# Altium schematic sheet EDU_High-Speed-Design_Ethernet.SchDoc: Ethernet
size 431 x 279 mm; Date: not used; ApprovedBy: not used; CheckedBy: not used; Author: not used; DrawnBy: not used; Organization: not used; Address4: not used; SheetNumber: 8; SheetTotal: 26; Time: not used; ImagePath: not used; Application_BuildNumber: not used
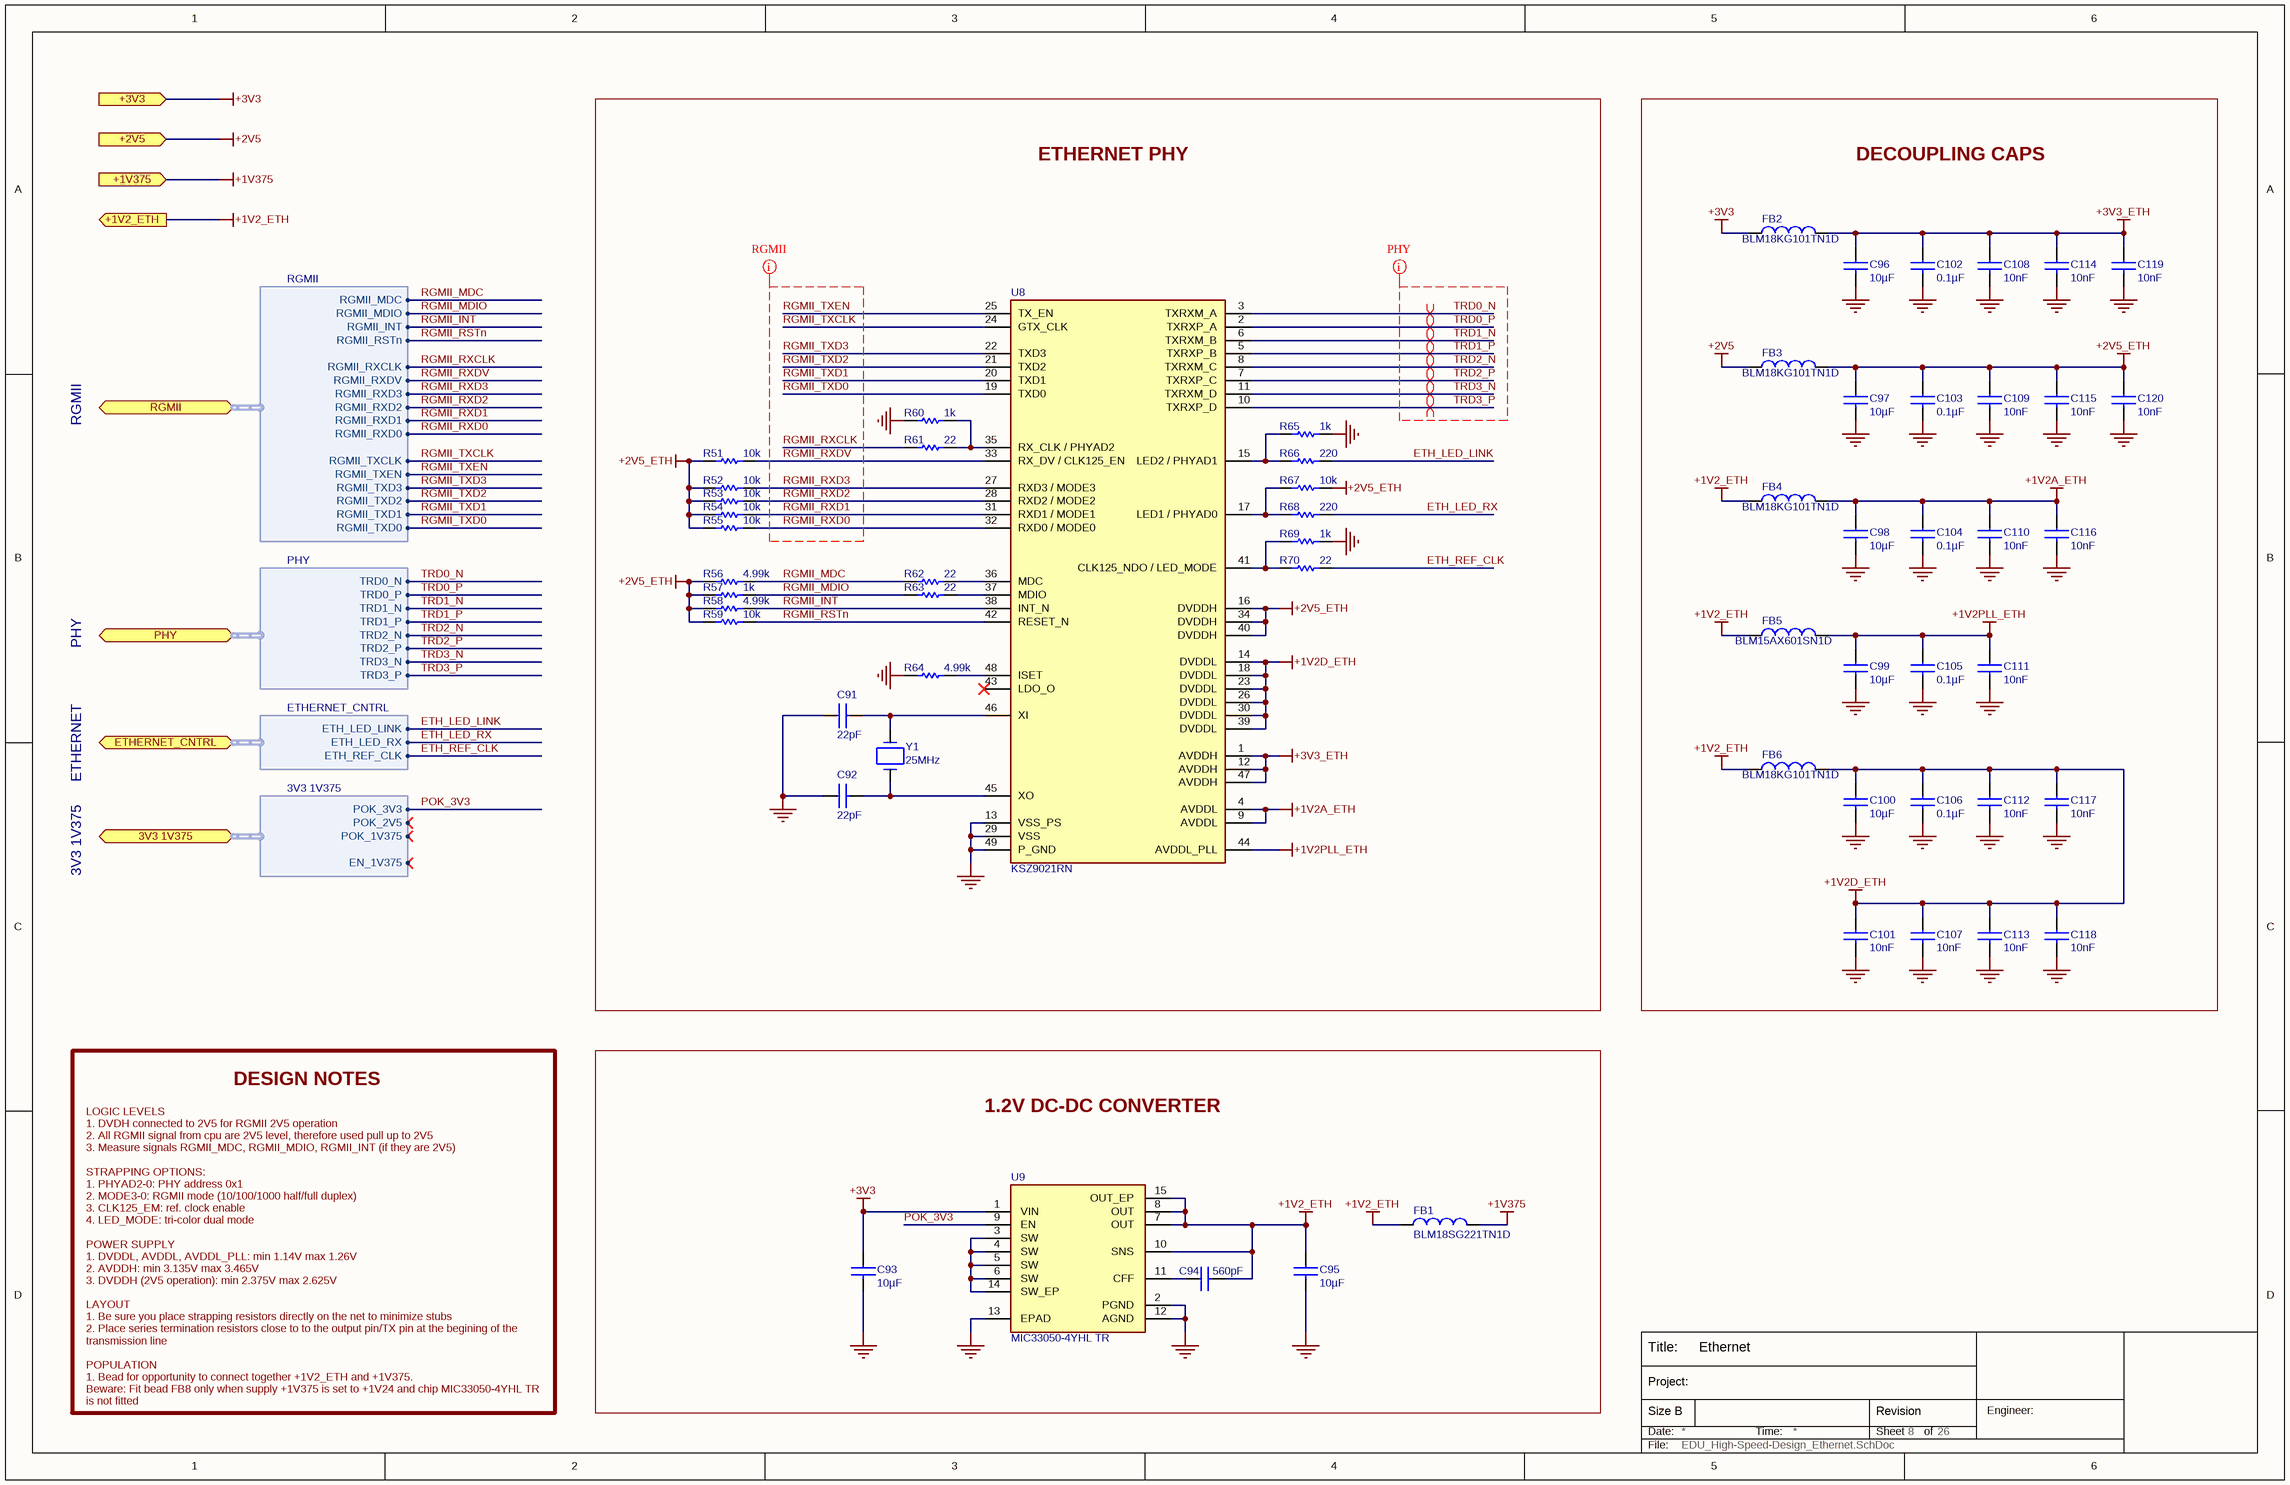
[diagram p0: EDU_High-Speed-Design_Ethernet.SchDoc]

## Parts
C91  22pF  [C0402]
C92  22pF  [C0402]
C93  10µF  [C0603]
C94  560pF  [C0402]
C95  10µF  [C0603]
C96  10µF  [C0603]
C97  10µF  [C0603]
C98  10µF  [C0603]
C99  10µF  [C0603]
C100  10µF  [C0603]
C101  10nF  [C0402]
C102  0.1µF  [C0402]
C103  0.1µF  [C0402]
C104  0.1µF  [C0402]
C105  0.1µF  [C0402]
C106  0.1µF  [C0402]
C107  10nF  [C0402]
C108  10nF  [C0402]
C109  10nF  [C0402]
C110  10nF  [C0402]
C111  10nF  [C0402]
C112  10nF  [C0402]
C113  10nF  [C0402]
C114  10nF  [C0402]
C115  10nF  [C0402]
C116  10nF  [C0402]
C117  10nF  [C0402]
C118  10nF  [C0402]
C119  10nF  [C0402]
C120  10nF  [C0402]
FB1  BLM18SG221TN1D  [L0603]
FB2  BLM18KG101TN1D  [L0603]
FB3  BLM18KG101TN1D  [L0603]
FB4  BLM18KG101TN1D  [L0603]
FB5  BLM15AX601SN1D  [L0402]
FB6  BLM18KG101TN1D  [L0603]
R51  10k  [R0402]
R52  10k  [R0402]
R53  10k  [R0402]
R54  10k  [R0402]
R55  10k  [R0402]
R56  4.99k  [R0402]
R57  1k  [R0402]
R58  4.99k  [R0402]
R59  10k  [R0402]
R60  1k  [R0402]
R61  22  [R0402]
R62  22  [R0402]
R63  22  [R0402]
R64  4.99k  [R0402]
R65  1k  [R0402]
R66  220  [R0402]
R67  10k  [R0402]
R68  220  [R0402]
R69  1k  [R0402]
R70  22  [R0402]
U8  KSZ9021RN  [KSZ9021RN]
U9  MIC33050-4YHL TR  [MIC33050-4YHL TR]
Y1  25MHz  [ABM7]

## Blocks framed on the sheet
ETHERNET PHY: C91 C92 R51-R70 U8 Y1
DECOUPLING CAPS: C96-C120 FB2-FB6
1.2V DC-DC CONVERTER: C93-C95 FB1 U9

## Ports
3V3 1V375 (bidir, harness 3V3 1V375), +1V2_ETH (out), +1V375 (in), +2V5 (in), +3V3 (in), ETHERNET_CNTRL (bidir, harness ETHERNET_CNTRL), PHY (bidir, harness PHY), RGMII (bidir, harness RGMII)

## Harnesses
RGMII: RGMII_TXCLK, RGMII_TXEN, RGMII_TXD2, RGMII_TXD0, RGMII_TXD1, RGMII_TXD3, RGMII_RXDV, RGMII_RXCLK, RGMII_RXD3, RGMII_RXD2, RGMII_RXD1, RGMII_RXD0, RGMII_RSTn, RGMII_INT, RGMII_MDIO, RGMII_MDC
PHY: TRD0_N, TRD0_P, TRD1_N, TRD2_N, TRD2_P, TRD3_N, TRD1_P, TRD3_P
ETHERNET_CNTRL: ETH_LED_LINK, ETH_REF_CLK, ETH_LED_RX
3V3 1V375: POK_3V3, POK_1V375, POK_2V5, EN_1V375

## Nets
+1V2_ETH: C94.2 C95.1 FB1.1 FB4.1 FB5.1 FB6.1 U9.7(OUT) U9.8(OUT) U9.10(SNS) U9.15(OUT_EP) ; port +1V2_ETH
+1V2A_ETH: C98.1 C104.1 C110.1 C116.1 FB4.2 U8.4(AVDDL) U8.9(AVDDL)
+1V2D_ETH: C100.1 C101.1 C106.1 C107.1 C112.1 C113.1 C117.1 C118.1 FB6.2 U8.14(DVDDL) U8.18(DVDDL) U8.23(DVDDL) U8.26(DVDDL) U8.30(DVDDL) U8.39(DVDDL)
+1V2PLL_ETH: C99.1 C105.1 C111.1 FB5.2 U8.44(AVDDL_PLL)
+1V375: FB1.2 ; port +1V375
+2V5: FB3.1 ; port +2V5
+2V5_ETH: C97.1 C103.1 C109.1 C115.1 C120.1 FB3.2 R51.1 R52.1 R53.1 R54.1 R55.1 R56.2 R57.2 R58.2 R59.1 R67.2 U8.16(DVDDH) U8.34(DVDDH) U8.40(DVDDH)
+3V3: C93.1 FB2.1 U9.1(VIN) ; port +3V3
+3V3_ETH: C96.1 C102.1 C108.1 C114.1 C119.1 FB2.2 U8.1(AVDDH) U8.12(AVDDH) U8.47(AVDDH)
GND: C91.1 C92.1 C93.2 C95.2 C96.2 C97.2 C98.2 C99.2 C100.2 C101.2 C102.2 C103.2 C104.2 C105.2 C106.2 C107.2 C108.2 C109.2 C110.2 C111.2 C112.2 C113.2 C114.2 C115.2 C116.2 C117.2 C118.2 C119.2 C120.2 R60.2 R64.2 R65.1 R69.1 U8.13(VSS_PS) U8.29(VSS) U8.49(P_GND) U9.2(PGND) U9.12(AGND) U9.13(EPAD)
ETH_LED_LINK: R66.1 ; port ETHERNET_CNTRL.ETH_LED_LINK
ETH_LED_RX: R68.1 ; port ETHERNET_CNTRL.ETH_LED_RX
ETH_REF_CLK: R70.1 ; port ETHERNET_CNTRL.ETH_REF_CLK
POK_3V3: U9.9(EN) ; port 3V3 1V375.POK_3V3
RGMII_INT: R58.1 U8.38(INT_N) ; port RGMII.RGMII_INT
RGMII_MDC: R56.1 R62.2 ; port RGMII.RGMII_MDC
RGMII_MDIO: R57.1 R63.2 ; port RGMII.RGMII_MDIO
RGMII_RSTn: R59.2 U8.42(RESET_N) ; port RGMII.RGMII_RSTn
RGMII_RXCLK: R61.2 ; port RGMII.RGMII_RXCLK
RGMII_RXD0: R55.2 U8.32(RXD0_/_MODE0) ; port RGMII.RGMII_RXD0
RGMII_RXD1: R54.2 U8.31(RXD1_/_MODE1) ; port RGMII.RGMII_RXD1
RGMII_RXD2: R53.2 U8.28(RXD2_/_MODE2) ; port RGMII.RGMII_RXD2
RGMII_RXD3: R52.2 U8.27(RXD3_/_MODE3) ; port RGMII.RGMII_RXD3
RGMII_RXDV: R51.2 U8.33(RX_DV_/_CLK125_EN) ; port RGMII.RGMII_RXDV
RGMII_TXCLK: U8.24(GTX_CLK) ; port RGMII.RGMII_TXCLK
RGMII_TXD0: U8.19(TXD0) ; port RGMII.RGMII_TXD0
RGMII_TXD1: U8.20(TXD1) ; port RGMII.RGMII_TXD1
RGMII_TXD2: U8.21(TXD2) ; port RGMII.RGMII_TXD2
RGMII_TXD3: U8.22(TXD3) ; port RGMII.RGMII_TXD3
RGMII_TXEN: U8.25(TX_EN) ; port RGMII.RGMII_TXEN
TRD0_N: U8.3(TXRXM_A) ; port PHY.TRD0_N
TRD0_P: U8.2(TXRXP_A) ; port PHY.TRD0_P
TRD1_N: U8.6(TXRXM_B) ; port PHY.TRD1_N
TRD1_P: U8.5(TXRXP_B) ; port PHY.TRD1_P
TRD2_N: U8.8(TXRXM_C) ; port PHY.TRD2_N
TRD2_P: U8.7(TXRXP_C) ; port PHY.TRD2_P
TRD3_N: U8.11(TXRXM_D) ; port PHY.TRD3_N
TRD3_P: U8.10(TXRXP_D) ; port PHY.TRD3_P
NetC91_2: C91.2 U8.46(XI) Y1.2
NetC92_2: C92.2 U8.45(XO) Y1.1
NetC94_1: C94.1 U9.11(CFF)
NetR60_1: R60.1 R61.1 U8.35(RX_CLK_/_PHYAD2)
NetR62_1: R62.1 U8.36(MDC)
NetR63_1: R63.1 U8.37(MDIO)
NetR64_1: R64.1 U8.48(ISET)
NetR65_2: R65.2 R66.2 U8.15(LED2_/_PHYAD1)
NetR67_1: R67.1 R68.2 U8.17(LED1_/_PHYAD0)
NetR69_2: R69.2 R70.2 U8.41(CLK125_NDO_/_LED_MODE)
NetU9_3: U9.3(SW) U9.4(SW) U9.5(SW) U9.6(SW) U9.14(SW_EP)

Not connected (* = marked no-connect by the designer): U8 43(LDO_O)*

## Layout directives
net class RGMII; rule Impedance Constraint [Min = 45.00    Max = 55.00    ]; rule Matched Net Lengths [Tolerance = 25mil]: RGMII_RXCLK, RGMII_RXD0, RGMII_RXD1, RGMII_RXD2, RGMII_RXD3, RGMII_RXDV, RGMII_TXCLK, RGMII_TXD0, RGMII_TXD1, RGMII_TXD2, RGMII_TXD3, RGMII_TXEN
differential pair: TRD0_N, TRD0_P, TRD1_N, TRD1_P, TRD2_N, TRD2_P, TRD3_N, TRD3_P
net class PHY; rule Impedance Constraint [Min = 90.00    Max = 110.0    ]; rule Matched Net Lengths [Tolerance = 50mil]: TRD0_N, TRD0_P, TRD1_N, TRD1_P, TRD2_N, TRD2_P, TRD3_N, TRD3_P

## Notes on the sheet
- RGMII
- PHY
- ETHERNET
- 3V3 1V375
- DESIGN NOTES
- LOGIC LEVELS
  1. DVDH connected to 2V5 for RGMII 2V5 operation
  2. All RGMII signal from cpu are 2V5 level, therefore used pull up to 2V5
  3. Measure signals RGMII_MDC, RGMII_MDIO, RGMII_INT (if they are 2V5)
  STRAPPING OPTIONS:
  1. PHYAD2-0: PHY address 0x1
  2. MODE3-0: RGMII mode (10/100/1000 half/full duplex)
  3. CLK125_EM: ref. clock enable
  4. LED_MODE: tri-color dual mode
  POWER SUPPLY
  1. DVDDL, AVDDL, AVDDL_PLL: min 1.14V max 1.26V
  2. AVDDH: min 3.135V max 3.465V
  3. DVDDH (2V5 operation): min 2.375V max 2.625V
  LAYOUT
  1. Be sure you place strapping resistors directly on the net to minimize stubs
  2. Place series termination resistors close to to the output pin/TX pin at the begining of the transmission line
  POPULATION
  1. Bead for opportunity to connect together +1V2_ETH and +1V375.
  Beware: Fit bead FB8 only when supply +1V375 is set to +1V24 and chip MIC33050-4YHL TR is not fitted
- Title:
- Date:
- Size B
- Project:
- Time:
- Sheet
- Revision
- of
- Engineer:
- File:

## Library data of the parts
C91 C92 = C1005C0G1H220J: CAP CER 22PF 50V C0G 5% 0402; Manufacturer 1: TDK Corporation; Capacitance: 22pF; Manufacturer Part Number 1: C1005C0G1H220J; Supplier 1: Digi-Key; Supplier Part Number 1: 445-1239-1-ND; ComponentLink1URL: http://www.tdk.co.jp/tefe02/e412_c.pdf; ComponentLink1Description: http://www.tdk.co.jp/tefe02/e412_c.pdf; Voltage: 50V
C93 C95-C100 = C1608X5R0J106M: CAP CER 10UF 6.3V X5R 20% 0603; Manufacturer 1: TDK Corporation; Capacitance: 10µF; Manufacturer Part Number 1: C1608X5R0J106M; Voltage: 6.3V; Supplier 1: Digi-Key; Supplier Part Number 1: 445-4112-1-ND; ComponentLink1URL: http://www.tdk.com/pdf/general_B11.pdf; ComponentLink1Description: http://www.tdk.com/pdf/general_B11.pdf
C94 = GRM1555C1H561JA01D: CAP CER 560PF 50V C0G 0402; Manufacturer 1: Murata Electronics North America; Capacitance: 560pF; Manufacturer Part Number 1: GRM1555C1H561JA01D; Voltage: 50V; Supplier 1: Digi-Key; Supplier Part Number 1: 490-3238-1-ND; ComponentLink1URL: http://search.murata.co.jp/Ceramy/image/img/PDF/ENG/GRM1555C1H561JA01.pdf; ComponentLink1Description: http://search.murata.co.jp/Ceramy/image/img/PDF/ENG/GRM1555C1H561JA01.pdf
C101 C107-C120 = C1005X7R1C103K: CAP CER 10000PF 16V X7R 10% 0402; Manufacturer: TDK Corporation; Capacitance: 10nF; Manufacturer Part Number: C1005X7R1C103K; Voltage: 16V; Supplier 1: Digi-Key; Supplier Part Number 1: 445-1262-1-ND; ComponentLink1URL: http://www.tdk.co.jp/tefe02/e412_c.pdf; ComponentLink1Description: http://www.tdk.co.jp/tefe02/e412_c.pdf
C102-C106 = C1005X5R1H104K: CAP CER .10UF 50V X5R 10% 0402; Manufacturer 1: TDK Corporation; Capacitance: 0.1µF; Manufacturer Part Number 1: C1005X5R1H104K; Voltage: 50V; Supplier 1: Digi-Key; Supplier Part Number 1: 445-5942-1-ND; ComponentLink1URL: http://www.tdk.co.jp/tefe02/e412_c.pdf; ComponentLink1Description: http://www.tdk.co.jp/tefe02/e412_c.pdf
FB1 = BLM18SG221TN1D: FERRITE CHIP 220 OHM 2500MA 0603; Manufacturer 1: Murata Electronics North America; Supplier 1: Digi-Key; Supplier Part Number 1: 490-5225-1-ND; Manufacturer Part Number 1: BLM18SG221TN1D; ComponentLink1URL: http://search.murata.co.jp/Ceramy/image/img/PDF/ENG/L0110S0100BLM18S.pdf; ComponentLink1Description: http://search.murata.co.jp/Ceramy/image/img/PDF/ENG/L0110S0100BLM18S.pdf
FB2-FB4 FB6 = BLM18KG101TN1D: FERRITE CHIP 100 OHM BEAD 0603 3A; Manufacturer 1: Murata Electronics North America; Manufacturer Part Number 1: BLM18KG101TN1D; Supplier 1: Digi-Key; Supplier Part Number 1: 490-5448-1-ND; ComponentLink1URL: http://search.murata.co.jp/Ceramy/image/img/PDF/ENG/L0110S0100BLM18K.pdf; ComponentLink1Description: http://search.murata.co.jp/Ceramy/image/img/PDF/ENG/L0110S0100BLM18K.pdf
FB5 = BLM15AX601SN1D: FERRITE CHIP 600 OHM 0402 420mA; Manufacturer 1: Murata Electronics North America; Manufacturer Part Number 1: BLM15AX601SN1D; Supplier 1: Digi-Key; Supplier Part Number 1: 490-5441-1-ND; ComponentLink1URL: http://search.murata.co.jp/Ceramy/image/img/PDF/ENG/L0110S0100BLM15AX_SN.pdf; ComponentLink1Description: http://search.murata.co.jp/Ceramy/image/img/PDF/ENG/L0110S0100BLM15AX_SN.pdf
R51-R55 R59 R67 = RC0402FR-0710KL: RES 10.0K OHM 1/16W 1% 0402 SMD; Manufacturer 1: Yageo; Manufacturer Part Number 1: RC0402FR-0710KL; Resistance: 10k; Supplier 1: Digi-Key; Supplier Part Number 1: 311-10.0KLRCT-ND; ComponentLink1URL: http://www.yageo.com/documents/recent/PYu-RC0402_51_RoHS_L_6.pdf; ComponentLink1Description: http://www.yageo.com/documents/recent/PYu-RC0402_51_RoHS_L_6.pdf
R56 R58 R64 = RMCF0402FT4K99: RES TF 4.99K OHM 1% 1/16W 0402; Manufacturer 1: Stackpole Electronics Inc; Manufacturer Part Number 1: RMCF0402FT4K99; Resistance: 4.99k; Supplier 1: Digi-Key; Supplier Part Number 1: RMCF0402FT4K99CT-ND; ComponentLink1URL: http://www.seielect.com/Catalog/SEI-RMCF.pdf; ComponentLink1Description: http://www.seielect.com/Catalog/SEI-RMCF.pdf
R57 R60 R65 R69 = RC0402FR-071KL: RES 1.00K OHM 1/16W 1% 0402 SMD; Manufacturer 1: Yageo; Manufacturer Part Number 1: RC0402FR-071KL; Resistance: 1k; Supplier 1: Digi-Key; Supplier Part Number 1: 311-1.00KLRCT-ND; ComponentLink1URL: http://www.yageo.com/documents/recent/PYu-RC0402_51_RoHS_L_6.pdf; ComponentLink1Description: http://www.yageo.com/documents/recent/PYu-RC0402_51_RoHS_L_6.pdf
R61-R63 R70 = RC0402FR-0722RL: RES 22.0 OHM 1/16W 1% 0402 SMD; Manufacturer 1: Yageo; Manufacturer Part Number 1: RC0402FR-0722RL; Resistance: 22; Supplier 1: Digi-Key; Supplier Part Number 1: 311-22.0LRCT-ND; ComponentLink1URL: http://www.yageo.com/documents/recent/PYu-RC0402_51_RoHS_L_6.pdf; ComponentLink1Description: http://www.yageo.com/documents/recent/PYu-RC0402_51_RoHS_L_6.pdf
R66 R68 = RC0402FR-07220RL: RES 220 OHM 1/16W 1% 0402 SMD; Manufacturer 1: Yageo; Manufacturer Part Number 1: RC0402FR-07220RL; Resistance: 220; Supplier 1: Digi-Key; Supplier Part Number 1: 311-220LRCT-ND; ComponentLink1URL: http://www.yageo.com/documents/recent/PYu-RC0402_51_RoHS_L_6.pdf; ComponentLink1Description: http://www.yageo.com/documents/recent/PYu-RC0402_51_RoHS_L_6.pdf
U8 = KSZ9021RN: IC TXRX 10/100/1000 SGL 48QFN; Manufacturer 1: Micrel Inc; Supplier 1: Digi-Key; Manufacturer Part Number 1: KSZ9021RN; Supplier Part Number 1: 576-3637-ND
U9 = MIC33050-4YHL TR: IC PWM REG 600mA 1.2V 12-MLF; Manufacturer 1: Micrel Inc; Manufacturer Part Number 1: MIC33050-4YHL TR; Supplier 1: Digi-Key; Supplier Part Number 1: 576-3044-1-ND
Y1 = ABM7-25.000MHZ-D-2-Y-T V1.1: CRYSTAL 25.0000 MHZ 18PF SMD; Manufacturer 1: Abracon Corporation; Manufacturer Part Number 1: ABM7-25.000MHZ-D-2-Y-T; Frequency: 25MHz; Supplier 1: Digi-Key; Supplier Part Number 1: 535-9847-1-ND; ComponentLink1URL: http://www.abracon.com/Resonators/abm7.pdf; ComponentLink1Description: http://www.abracon.com/Resonators/abm7.pdf